# EAGLE schematic Sensor_Board_2.01_HX711_DS18b2 (EAGLE 9.6.2)
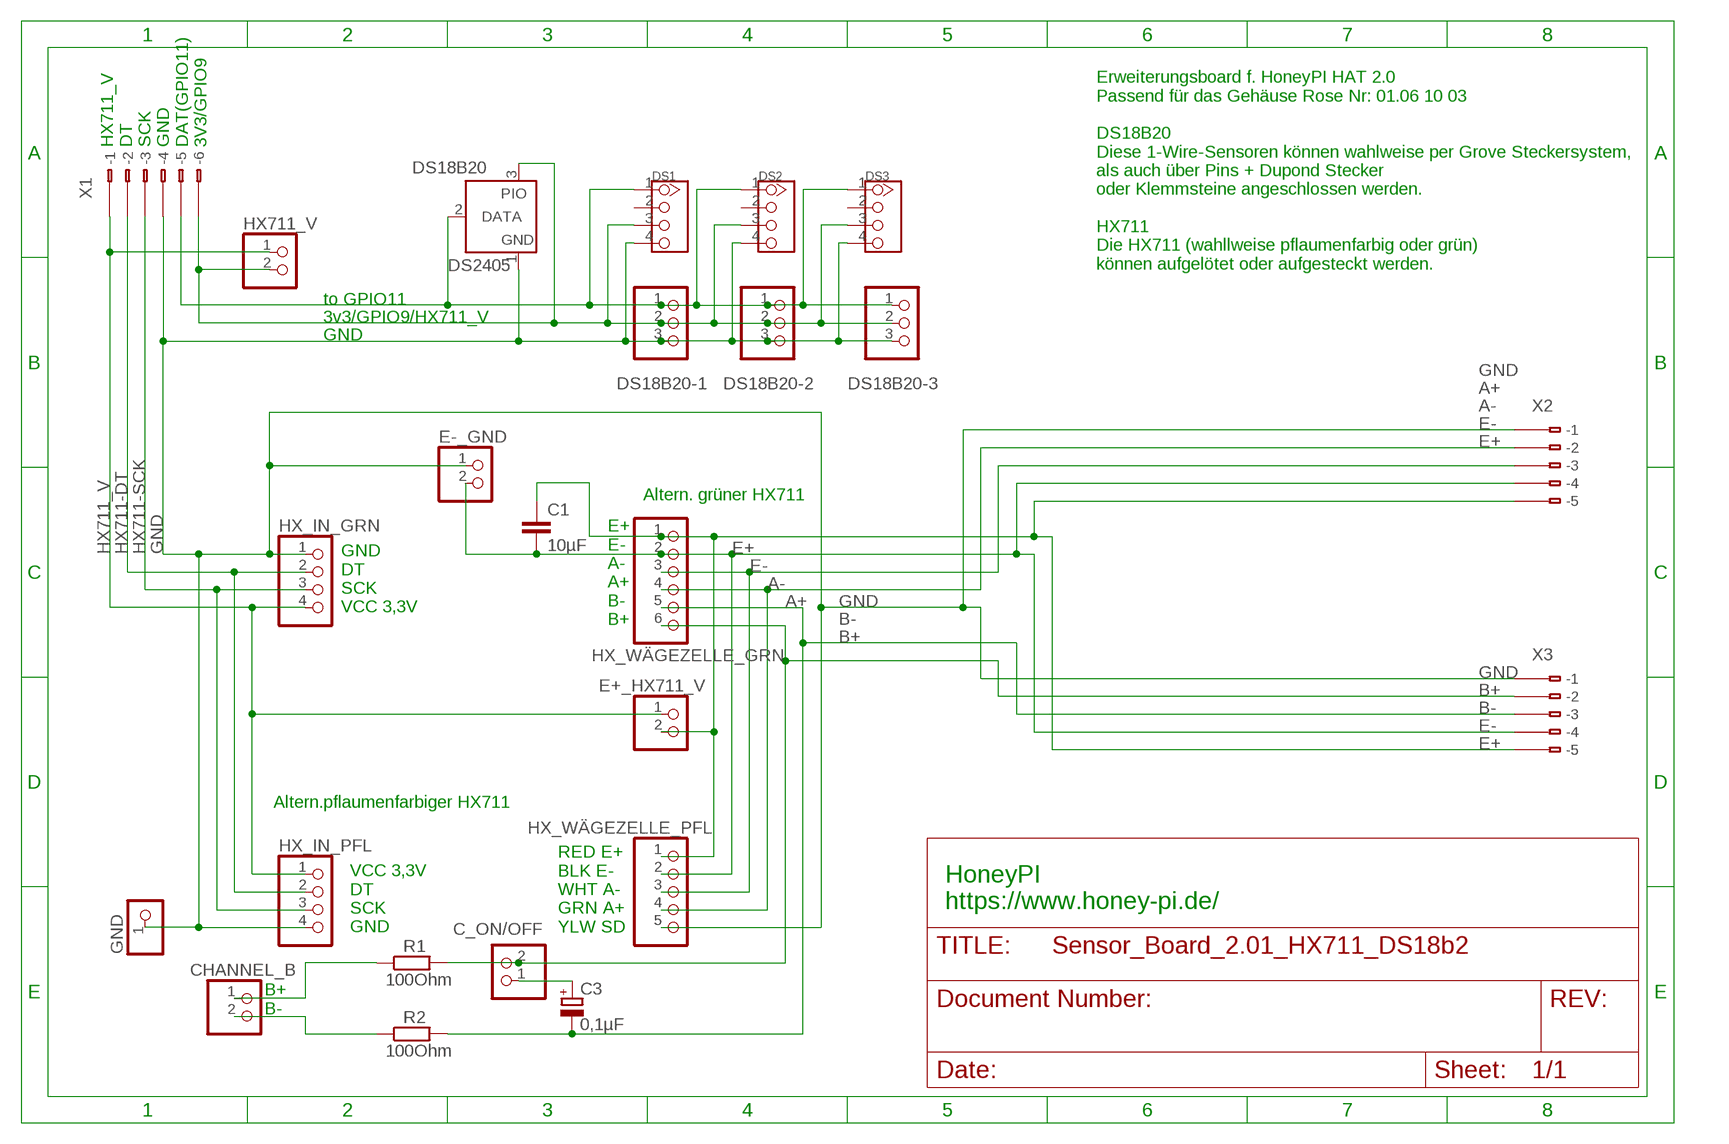
[diagram p0: schematic, sheet 1]

## Parts
C1  10µF  C5/2.5  [C5B2.5]
C3  0,1µF  CPOL-EUE2.5-7  [E2,5-7]
C_ON/OFF  PINHD-1X2  [1X02]
CHANNEL_B  PINHD-1X2  [1X02]
DS1  TWIG-4P-2.0-2.0  [4P-2.0]
DS2  TWIG-4P-2.0-2.0  [4P-2.0]
DS3  TWIG-4P-2.0-2.0  [4P-2.0]
DS18B20  DS2405  [TO92-]
DS18B20-1  PINHD-1X3  [1X03]
DS18B20-2  PINHD-1X3  [1X03]
DS18B20-3  PINHD-1X3  [1X03]
E+_HX711_V  PINHD-1X2  [1X02]
E-_GND  PINHD-1X2  [1X02]
GND  PINHD-1X1  [1X01]
HX711_V  PINHD-1X2  [1X02]
HX_IN_GRN  PINHD-1X4  [1X04]
HX_IN_PFL  PINHD-1X4  [1X04]
HX_WÄGEZELLE_GRN  PINHD-1X6  [1X06]
HX_WÄGEZELLE_PFL  PINHD-1X5  [1X05]
R1  100Ohm  R-EU_0207/10  [0207/10]
R2  100Ohm  R-EU_0207/10  [0207/10]
X1  233-506  [233-506]
X2  233-505  [233-505]
X3  233-505  [233-505]

## Nets
3V3 [Supply3v3]: DS1.3 DS2.3 DS3.3 DS18B20-1.2 DS18B20-2.2 DS18B20-3.2 DS18B20.3(PIO) HX711_V.2 X1.B6(B-6)
A+: HX_WÄGEZELLE_GRN.4 HX_WÄGEZELLE_PFL.4 X2.B2(B-2)
A-: HX_WÄGEZELLE_GRN.3 HX_WÄGEZELLE_PFL.3 X2.B3(B-3)
B+: C_ON/OFF.2 HX_WÄGEZELLE_GRN.6 R1.2 X3.B2(B-2)
B-: C3.- HX_WÄGEZELLE_GRN.5 R2.2 X3.B3(B-3)
DS18B20_DATA_GPIO11_PIN23: DS1.1 DS2.1 DS3.1 DS18B20-1.1 DS18B20-2.1 DS18B20-3.1 DS18B20.2(DATA) X1.B5(B-5)
E+: C1.1 E+_HX711_V.2 HX_WÄGEZELLE_GRN.1 HX_WÄGEZELLE_PFL.1 X2.B5(B-5) X3.B5(B-5)
E-: C1.2 E-_GND.2 HX_WÄGEZELLE_GRN.2 HX_WÄGEZELLE_PFL.2 X2.B4(B-4) X3.B4(B-4)
GND [Supply3v3]: DS1.4 DS2.4 DS3.4 DS18B20-1.3 DS18B20-2.3 DS18B20-3.3 DS18B20.1(GND) E-_GND.1 GND.1 HX_IN_GRN.1 HX_IN_PFL.4 HX_WÄGEZELLE_PFL.5 X1.B4(B-4) X2.B1(B-1) X3.B1(B-1)
HX711-DT: HX_IN_GRN.2 HX_IN_PFL.2 X1.B2(B-2)
HX711-SCK: HX_IN_GRN.3 HX_IN_PFL.3 X1.B3(B-3)
HX711_V [Supply5v]: E+_HX711_V.1 HX711_V.1 HX_IN_GRN.4 HX_IN_PFL.1 X1.B1(B-1)
N$1: CHANNEL_B.1 R1.1
N$2: CHANNEL_B.2 R2.1
N$3: C3.+ C_ON/OFF.1
Unconnected: DS1.2 DS2.2 DS3.2 X1.A1(-1) X1.A2(-2) X1.A3(-3) X1.A4(-4) X1.A5(-5) X1.A6(-6) X2.A1(-1) X2.A2(-2) X2.A3(-3) X2.A4(-4) X2.A5(-5) X3.A1(-1) X3.A2(-2) X3.A3(-3) X3.A4(-4) X3.A5(-5)

## Notes on the sheet
- HX711_V
  DT
  SCK
  GND
  DAT(GPIO11)
  3V3/GPIO9
- Erweiterungsboard f. HoneyPI HAT 2.0
  Passend für das Gehäuse Rose Nr: 01.06 10 03 
  
  DS18B20
  Diese 1-Wire-Sensoren können wahlweise per Grove Steckersystem,
  als auch über Pins + Dupond Stecker
  oder Klemmsteine angeschlossen werden.
  
  HX711
  Die HX711 (wahllweise pflaumenfarbig oder grün)
  können aufgelötet oder aufgesteckt werden.
- to GPIO11
- 3v3/GPIO9/HX711_V
- GND
- Altern. grüner HX711
- GND
  DT
  SCK
  VCC 3,3V
- E+
  E-
  A-
  A+
  B-
  B+
- Altern.pflaumenfarbiger HX711
- HoneyPI
  https://www.honey-pi.de/
- VCC 3,3V
  DT
  SCK
  GND
- RED E+
  BLK E-
  WHT A-
  GRN A+
  YLW SD
- B+
  B-

## Library data of the parts
C1 = capacitor-wima:C: CAPACITOR naming: grid - package width
C3 = rcl:CPOL-EU: POLARIZED CAPACITOR, European symbol; SPICEPREFIX: C
C_ON/OFF CHANNEL_B E+_HX711_V E-_GND HX711_V = pinhead:PINHD-1X2: PIN HEADER
DS1-DS3 = Connector:TWIG-4P-2.0
DS18B20 = maxim:DS2405: Addressable Switch DALLAS Semiconductor; MF: DALLAS SEMICONDUCTOR; MPN: DS2405; OC_FARNELL: 1188025; OC_NEWARK: 06F4645
DS18B20-1-DS18B20-3 = pinhead:PINHD-1X3: PIN HEADER
GND = pinhead:PINHD-1X1: PIN HEADER
HX_IN_GRN HX_IN_PFL = pinhead:PINHD-1X4: PIN HEADER
HX_WÄGEZELLE_GRN = pinhead:PINHD-1X6: PIN HEADER
HX_WÄGEZELLE_PFL = pinhead:PINHD-1X5: PIN HEADER
R1 R2 = rcl:R-EU_: RESISTOR, European symbol; SPICEPREFIX: R
X1 = con-wago:233-506: WAGO Cage Clamp; MF: Wago Corporation; MPN: 0233-0506; OC_FARNELL: 1777100; OC_NEWARK: 79K2052
X2 X3 = con-wago:233-505: WAGO Cage Clamp; MF: Wago Corporation; MPN: 0233-0505; OC_FARNELL: unknown; OC_NEWARK: 79K2051

## Net classes
0 Signal: width 0.152 mm, clearance 0.305 mm
1 Supply3v3: width 0.203 mm, clearance 0.305 mm
2 Supply5v: width 0.406 mm, clearance 0.305 mm